# EAGLE design ultra-violet-tooth-sensor-mk-2.2 (EAGLE 6.5.0)
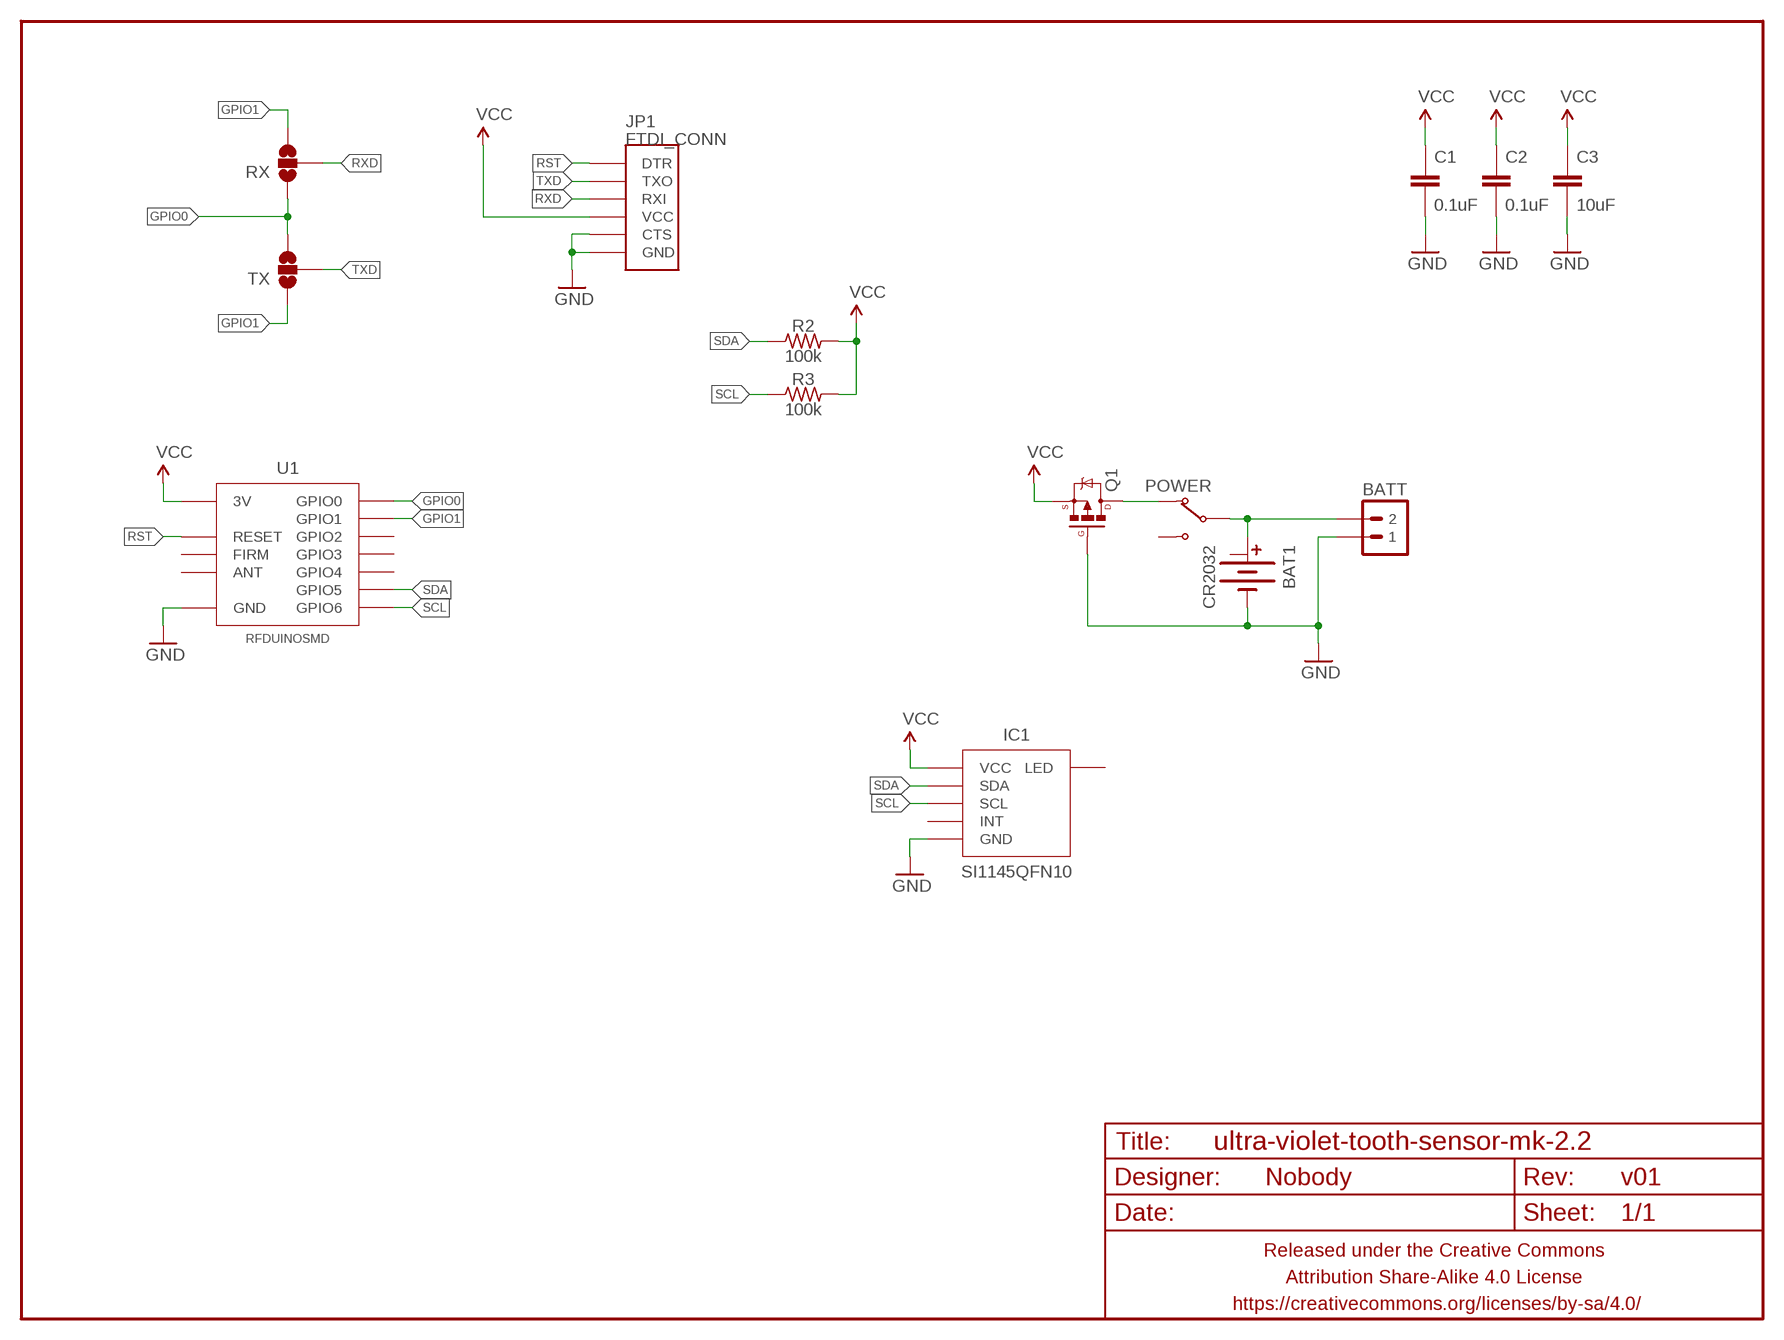
[diagram p0: schematic, sheet 1]

## Parts
BAT1  CR2032  BATTERY-COINCR2032_SMD_TIGHT  [BATTCON_20MM_MINE_STAHPIT]
BATT  M02PTH-CENTERED-R+  [1X02-CENTER-R+]
C1  0.1uF  CAPACITOR-CERAMICC0805  [C0805]
C2  0.1uF  CAPACITOR-CERAMICC0805  [C0805]
C3  10uF  CAPACITOR-CERAMICC1206  [C1206]
FRAME1  FRAME-LETTERNO_PACKAGE  [DUMMY]
IC1  SI1145QFN10  [SI1145]
JP1  FTDI_CONN  [FTDI_CONN]
POWER  SWITCH-SPDTPTH-RA-2.54MM  [SPDT-RA-2.54MM]
Q1  MOSFET-PCHANNELIRLML2244  [SOT23-3]
R2  100k  RESISTORR0805  [R0805]
R3  100k  RESISTORR0805  [R0805]
RX  JUMPER-PAD-3-NOFULL_BOX_SILK  [PAD-JUMPER-3-NO_YES_SILK_FULL_BOX]
TX  JUMPER-PAD-3-NOFULL_BOX_SILK  [PAD-JUMPER-3-NO_YES_SILK_FULL_BOX]
U1  RFDUINOSMD  [RFDUINO-SMD]

## Nets
GND: BAT1.BOTTOM(-) BATT.1 C1.2 C2.2 C3.2 IC1.GND JP1.CTS JP1.GND Q1.1(G) U1.GND@1(GND) U1.GND@2(GND) U1.GND@3(GND) U1.GND@4(GND) U1.GND@5(GND) U1.GND@6(GND) U1.GND@7(GND) U1.GND@8(GND)
GPIO0: RX.1 TX.3 U1.GPIO0
GPIO1: RX.3 TX.1 U1.GPIO1
N$1: BAT1.TOP@1(+) BATT.2 POWER.2(COM)
N$2: POWER.1(NC) Q1.3(D)
RST: JP1.DTR U1.RESET
RXD: JP1.RXI RX.2
SCL: IC1.SCL R3.1 U1.GPIO6
SDA: IC1.SDA R2.1 U1.GPIO5
TXD: JP1.TXO TX.2
VCC: C1.1 C2.1 C3.1 IC1.VCC@1(VCC) IC1.VCC@2(VCC) IC1.VCC@3(VCC) JP1.VCC Q1.2(S) R2.2 R3.2 U1.3V
Unconnected: BAT1.TOP@2(+1) IC1.INT IC1.LED POWER.3(NO) U1.ANT U1.FACTORY(FIRM) U1.GPIO2 U1.GPIO3 U1.GPIO4

## Library data of the parts
BAT1 = A_butts:BATTERY-COIN
BATT = A_butts:M02: Standard 2-pin 0.1" header. Use with - straight break away headers ( PRT-00116) - right angle break away headers (PRT-00553) - swiss pins (PRT-00743) - machine pins (PRT-00117) - female headers (PRT-00115) Molex polarized connector foot print use with: PRT-08233 with associated crimp pins and housings. 2.54_SCREWTERM for use with PRT-10571. 3.5mm Screw Terminal footprints for PRT-08084 5mm Screw Terminal footprints for use with PRT-08433
C1-C3 = A_butts:CAPACITOR-CERAMIC: CAPACITOR, European symbol
FRAME1 = A_butts:FRAME-LETTER: Schematic Frame Standard 8.5x11 US Letter frame; DESIGNER: Nobody; VERSION: v01
IC1 = A_butts:SI1145
JP1 = A_butts:FTDI_CONN: Connector which mates to FTDI basic or FTDI cable.
POWER = A_butts:SWITCH-SPDT
Q1 = A_butts:MOSFET-PCHANNEL: Generic PMOSFET IRLML2244 - TRANS-11153 (SOT-23 -20V -4.3A) (1.Gate 2.Source 3.Drain) FQP27P06 - COM-10349 <http://www.sparkfun.com/products/10349> (TO-220 -60V -27A) (1.Gate 2.Source 3.Drain); PROD_ID: TRANS-11153
R2 R3 = A_butts:RESISTOR: RESISTOR, American symbol
RX TX = A_butts:JUMPER-PAD-3-NO
U1 = A_butts:RFDUINO

## Board
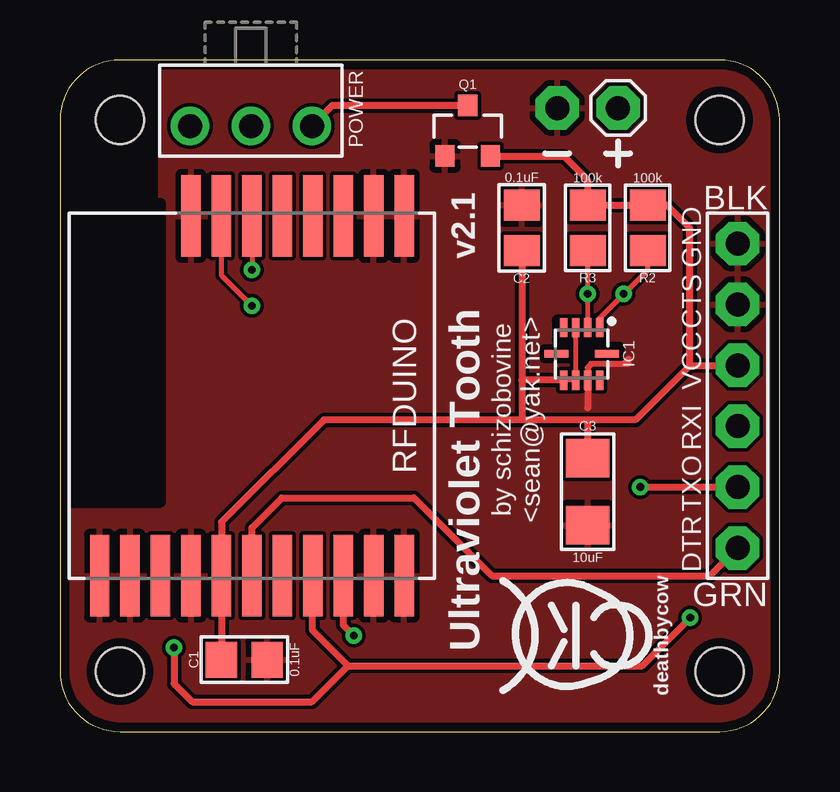
[diagram p1: board, top side]
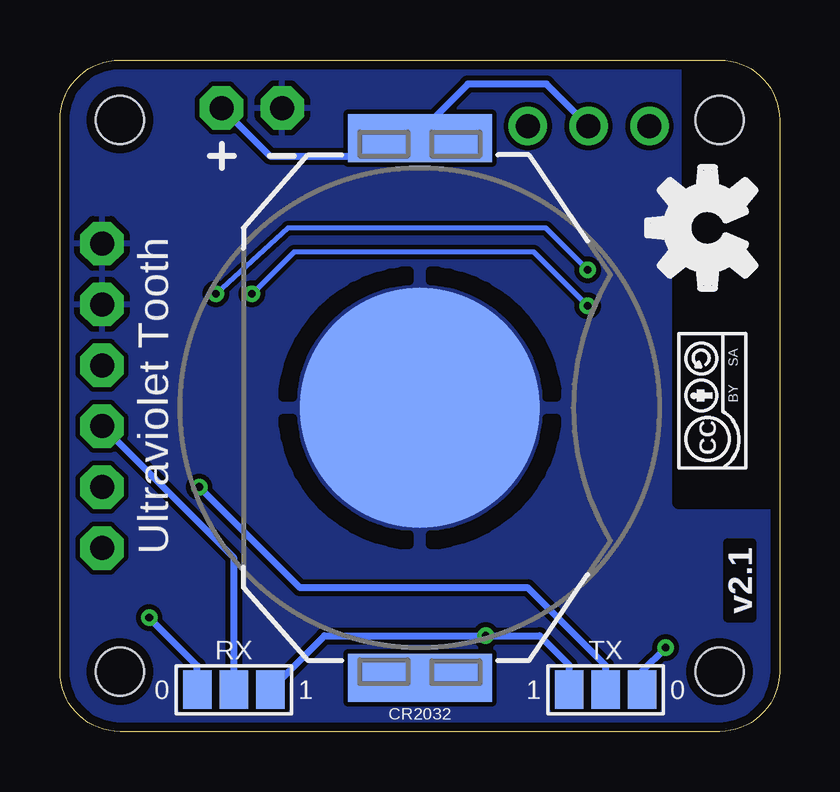
[diagram p2: board, bottom side, seen from below]

Size 30 x 28 mm. Coordinates in mm from the lower left corner, seen from the top.
Outline: 30,2.5 30,25.5 arc90 27.5,28 2.5,28 arc90 0,25.5 0,2.5 arc90 2.5,0 27.5,0 arc90 30,2.5
Copper layers (1*16): Top 0.0356mm / dielectric 1.5011mm / Bottom 0.0356mm
Design rules "LaenPCBOrder_2": minimum track width 6mil, minimum drill 13mil, track to track 6mil, track to pad 6mil, pad to pad 6mil, via to via 6mil, smd to smd 6mil, copper to edge 15mil, drill to drill 6mil, minimum pad ring 7mil, minimum via ring 7mil, stop-mask expansion 3mil, vias tented up to drill 20mil, thermal gap 10mil
Holes 2 mm at 2.5,25.5 2.5,2.5 27.5,25.5 27.5,2.5

### Footprints (pad centres in the part's own frame; a part is rotated, then mirrored left to right if it is on the bottom)
BATTCON_20MM_MINE_STAHPIT = smd 10 x 10: BOTTOM 0,0 | smd 6 x 2: TOP@1 0,11.25; TOP@2 0,-11.25
1X02-CENTER-R+ = drill 1 pad 1.8 octagon: 1 -1.27,0; 2 1.27,0
C0805 = smd 1.3 x 1.5: 1 -0.95,0; 2 0.95,0
C1206 = smd 1.6 x 1.8: 1 -1.4,0; 2 1.4,0
SI1145 = smd 0.8 x 0.3: GND 1.1,0.25; INT -1.1,-0.75; LED 1.1,0.75; SCL -1.1,0.25; SDA -1.1,0.75; VCC@1 -1.1,-0.25; VCC@2 1.1,-0.25; VCC@3 1.1,-0.75 | smd 0.3 x 1: NC@1 0,1.05; NC@2 0,-1.05
FTDI_CONN = drill 1 pad 1.8 octagon: CTS 3.81,0; DTR -6.35,0; GND 6.35,0; RXI -1.27,0; TXO -3.81,0; VCC 1.27,0
SPDT-RA-2.54MM = drill 1 pad 1.6: 1 0,0; 2 2.54,0; 3 5.08,0
SOT23-3 = smd 0.8 x 0.9: 1 -0.95,-1; 2 0.95,-1; 3 0,1.1
R0805 = smd 1.3 x 1.5: 1 -0.95,0; 2 0.95,0
PAD-JUMPER-3-NO_YES_SILK_FULL_BOX = smd 1.2 x 1.6: 1 -1.524,0; 2 0,0; 3 1.524,0
RFDUINO-SMD = smd 3.4 x 0.8: 3V 7.5,-1.27; ANT 7.5,-3.81; FACTORY 7.5,1.27; GND@1 -7.5,6.35; GND@2 -7.5,5.08; GND@3 -7.5,-2.54; GND@4 7.5,-6.35; GND@5 7.5,-5.08; GND@6 7.5,-2.54; GND@7 7.5,5.08; GND@8 7.5,6.35; GPIO0 7.5,2.54; GPIO1 7.5,3.81; GPIO2 -7.5,3.81; GPIO3 -7.5,2.54; GPIO4 -7.5,1.27; GPIO5 -7.5,0; GPIO6 -7.5,-1.27; RESET 7.5,0

### Placement (x,y rotation side)
BAT1  15,13.5 0 bottom
BATT  22,26 0 top
C1  7.68,3 0 top
C2  19.25,21 90 top
C3  22,10 270 top
FRAME1  0,0 180 top
IC1  21.75,15.75 270 top
JP1  28.25,14 90 top
POWER  10.5,25.25 180 top
Q1  17,25 0 top
R2  24.5,21 90 top
R3  22,21 90 top
RX  22.75,1.75 0 bottom
TX  7.25,1.75 0 bottom
U1  8,14 270 top
U$1  [CC-BY-SA-4.0-NO-URL]  2.8,13.8 90 bottom
U$5  [COW_SMALL]  21,4 90 top
U$6  [OSHWLOGO_SILKONLY]  3,21 90 bottom

### Tracks (layer width: path | path; a pad name or v marks a point on that pad's centre or on a via)
GND
  Top 0.24: 23.7,15.32 22.15,15.32 22,15.17 22,14.75 | 23.5,15.35 23.7,15.55
  Top 0.3: IC1.GND 22,13.5
  pour Top (isolate 0.152, rank 6): 30.1,28.1 30.1,-0.1 -0.1,-0.1 -0.1,9.5 4.15,9.5 4.15,28.1
  pour Bottom (isolate 0.2, rank 6): 30.1,28.1 30.1,-0.1 -0.1,-0.1 -0.1,9.5 4.15,9.5 4.15,28.1
GPIO0  (via drill 0.33)
  Top 0.3: 12,2.75 10.54,4.21 U1.GPIO0 | 12,2.75 24.27,2.75 v26.27,4.75 | v4.75,3.5 4.75,2 5.5,1.25 10.5,1.25 12,2.75
  Bottom 0.3: TX.3 5.73,2.52 v4.75,3.5 | RX.1 24.27,2.75 v26.27,4.75
GPIO1  (via drill 0.33)
  Top 0.3: U1.GPIO1 11.81,4.44 v12.25,4
  Bottom 0.3: TX.1 8.77,2.77 10,4 v12.25,4 18.98,4 RX.3
N$1
  Bottom 0.3: BATT.2 23.25,26 21.25,24 15.75,24 BAT1.TOP@1 15,25 13,27 9.71,27 POWER.2
N$2
  Top 0.3: Q1.3 11.35,26.1 POWER.1
RST
  Top 0.3: U1.RESET 8,8.5 9.25,9.75 14.75,9.75 18,6.5 27.1,6.5 JP1.DTR
RXD
  Bottom 0.3: RX.2 22.75,7.23 JP1.RXI
SCL  (via drill 0.33)
  Top 0.2: v8,17.75 6.73,19.02 U1.GPIO6 | R3.1 v22,18.25 IC1.SCL
  Bottom 0.2: v8,17.75 10.25,20 20.25,20 v22,18.25
SDA  (via drill 0.33)
  Top 0.2: U1.GPIO5 v8,19.25 | IC1.SDA 22.5,17.25 v23.5,18.25 24.5,19.25 R2.1
  Bottom 0.2: v8,19.25 9.75,21 20.5,21 v23.5,18.25
TXD  (via drill 0.33)
  Top 0.3: v24.19,10.19 JP1.TXO
  Bottom 0.3: TX.2 7.25,2.75 10.5,6 20,6 v24.19,10.19
VCC
  Top 0.2: IC1.VCC@1 IC1.VCC@2 IC1.VCC@3
  Top 0.3: 22,13 23.98,13 26.25,15.27 | 22,13 19.25,13 | C2.1 19.25,14.65 | 19.25,14.65 19.25,13 | 19.25,13 11,13 6.73,8.73 U1.3V C1.1 | Q1.2 21,24 22,23 R3.2 R2.2 25.3,21.95 26.25,21 26.25,15.27 | C3.1 22,13 | IC1.VCC@3 19.25,14.65 | 26.25,15.27 JP1.VCC

### Text on the board
tPlace: by schizobovine / <sean@yak.net> | Ultraviolet Tooth
bPlace: Ultraviolet Tooth | 0 | 1 | 1 | 0